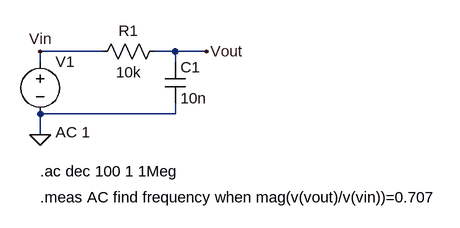
[diagram p0: schematic RC_Low_Pass_Passive_1590Hz_fc.asc]
RC_Low_Pass_Passive_1590Hz_fc.asc, the LTspice schematic file:
Version 4
SHEET 1 892 680
WIRE -192 96 -288 96
WIRE -80 96 -112 96
WIRE -32 96 -80 96
WIRE -288 112 -288 96
WIRE -80 112 -80 96
WIRE -80 192 -80 176
WIRE -80 192 -288 192
WIRE -288 224 -288 192
FLAG -32 96 Vout
FLAG -288 224 0
FLAG -288 96 Vin
SYMBOL voltage -288 96 R0
WINDOW 123 24 124 Left 2
WINDOW 39 0 0 Left 0
SYMATTR Value2 AC 1
SYMATTR InstName V1
SYMATTR Value ""
SYMBOL cap -96 112 R0
SYMATTR InstName C1
SYMATTR Value 10n
SYMBOL res -96 80 R90
WINDOW 0 0 56 VBottom 2
WINDOW 3 32 56 VTop 2
SYMATTR InstName R1
SYMATTR Value 10k
TEXT -288 280 Left 2 !.ac dec 100 1 1Meg
TEXT -288 320 Left 2 !.meas AC find frequency when mag(v(vout)/v(vin))=0.707

The netlist it stands for:
* RC_Low_Pass_Passive_1590Hz_fc.asc
V1 Vin 0 AC 1
C1 Vout 0 10n
R1 Vout Vin 10k
.ac dec 100 1 1Meg
.meas AC find frequency when mag(v(vout)/v(vin))=0.707
.backanno
.end

* Results of the author's LTspice run, read from the files saved beside the schematic
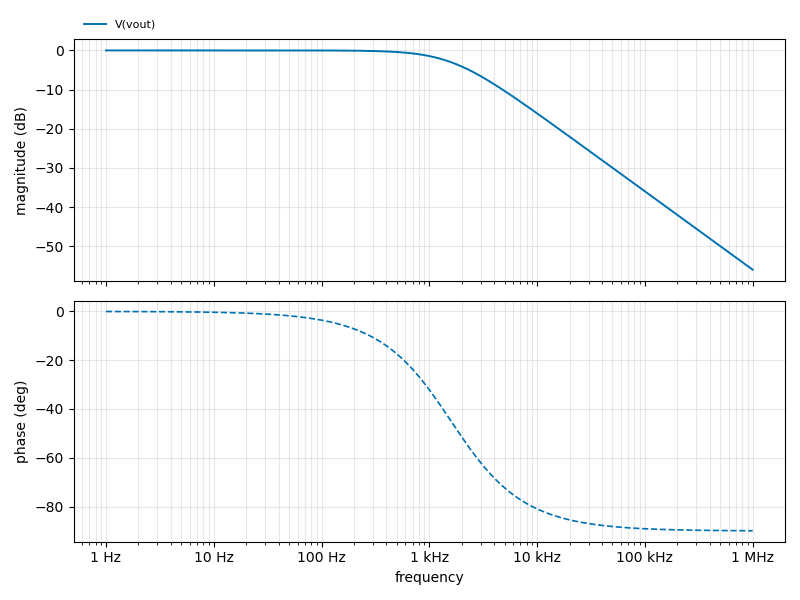
[diagram p1: AC Analysis of RC_Low_Pass_Passive_1590Hz_fc.asc, plotted from the saved traces]
* AC Analysis, 1 run:
*   V(vout): -0.00 dB at 1 Hz, -55.96 dB at 1 MHz, peak -0.00 dB at 1 Hz, 3 dB below the peak at 1.591 kHz
* From the log:
*   find: mag(v(vout)/v(vin))=0.707 AT 1592.06